# Altium schematic sheet 01_SYSTEM.SchDoc: NODE MCU DEVKIT V1.0
size A4; Date: 25/01/2015; Author: HuangRui <vowstar@gmail.com>; DrawnBy: JiYaping <jyp1817@gmail.com>; Organization: WWW.NODEMCU.COM
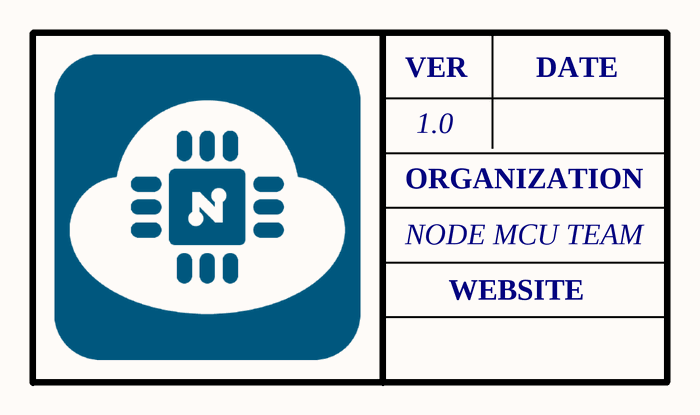
[diagram p0: 01_SYSTEM.SchDoc]

## Notes on the sheet
- VER
- 1.0
- DATE
- ORGANIZATION
- NODE MCU TEAM
- WEBSITE